# Altium schematic sheet Top.SchDoc: Top Level
size A3; CompanyName: NOT USED; SheetNumber: 0; SheetTotal: 0; PageSetup: Record=PageOptions|CenterHorizontal=True|CenterVertical=True|PrintScale=1.00|XCorrection=1.00|YCorrection=1.00|PrintKind=0|BorderSize=5000000|LeftOffset=0|BottomOffset=0|Orientation=2|PaperLength=1000|PaperWidth=1000|Scale=100|PaperSource=7|PrintQuality=-4|MediaType=1|DitherType=10|PaperKind=A3|PrintScaleMode=0
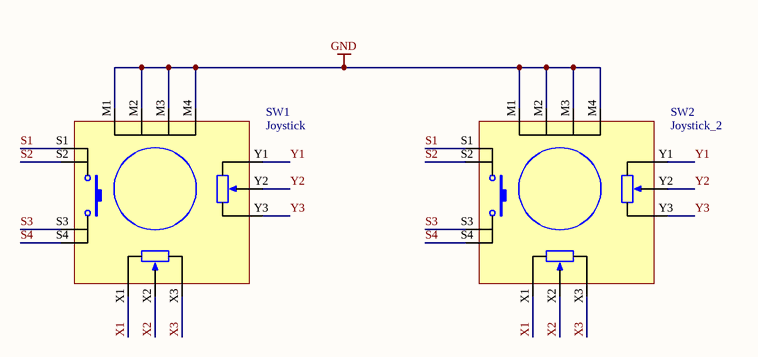
[diagram p0: Top.SchDoc]

## Parts
SW1  Joystick  [Joystick]
SW2  Joystick_2  [Joystick2]

## Nets
GND: SW1.M1 SW1.M2 SW1.M3 SW1.M4 SW2.M1 SW2.M2 SW2.M3 SW2.M4
S1: SW1.S1 SW2.S1
S2: SW1.S2 SW2.S2
S3: SW1.S3 SW2.S3
S4: SW1.S4 SW2.S4
X1: SW1.X1 SW2.X1
X2: SW1.X2 SW2.X2
X3: SW1.X3 SW2.X3
Y1: SW1.Y1 SW2.Y1
Y2: SW1.Y2 SW2.Y2
Y3: SW1.Y3 SW2.Y3

## Notes on the sheet
- Project
- Variant
- Sheet
- Design
- Client
- Revision
- Phone
- Date
- of
- Size
- Time
- A3
- File